# Altium project Switcher.PrjPcb
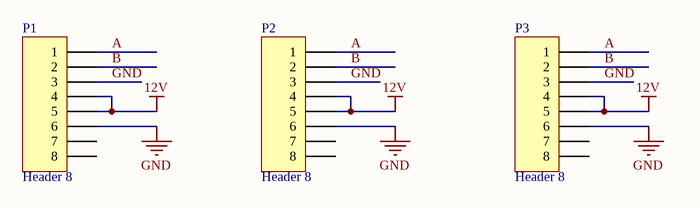
[diagram p0: Switcher.SchDoc]
1 sheet, 3 parts. Net scope: global (net labels, ports and power ports of the same name join across sheets).
Board file: Switcher.PcbDoc

## Sheet Switcher.SchDoc
size Legal

### Parts
P1  Header 8  [RJ11]
P2  Header 8  [RJ11]
P3  Header 8  [RJ11]

### Nets
12V: P1.4 P1.5 P2.4 P2.5 P3.4 P3.5
GND: P1.3 P1.6 P2.3 P2.6 P3.3 P3.6
A: P1.1 P2.1 P3.1
B: P1.2 P2.2 P3.2

Not connected (* = marked no-connect by the designer): P1 7 8; P2 7 8; P3 7 8

### Library data of the parts
P1-P3 = Header 8: Header, 8-Pin; LatestRevisionDate: 17-Jul-2002; LatestRevisionNote: Re-released for DXP Platform.; Publisher: Altium Limited